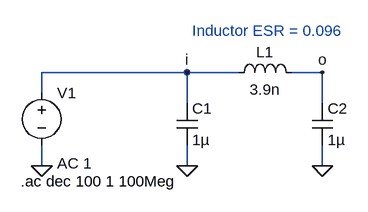
[diagram p0: schematic Pi_Filter_96mohm.asc]
Pi_Filter_96mohm.asc, the LTspice schematic file:
Version 4
SHEET 1 880 680
WIRE 64 96 -160 96
WIRE 144 96 64 96
WIRE 272 96 224 96
WIRE -160 128 -160 96
WIRE 64 144 64 96
WIRE 272 144 272 96
WIRE -160 240 -160 208
WIRE 64 240 64 208
WIRE 272 240 272 208
FLAG 64 240 0
FLAG 272 240 0
FLAG -160 240 0
FLAG 272 96 o
FLAG 64 96 i
SYMBOL cap 48 144 R0
SYMATTR InstName C1
SYMATTR Value 1µ
SYMBOL cap 256 144 R0
SYMATTR InstName C2
SYMATTR Value 1µ
SYMBOL ind 128 112 R270
WINDOW 0 32 56 VTop 2
WINDOW 3 5 56 VBottom 2
SYMATTR InstName L1
SYMATTR Value 3.9n
SYMATTR SpiceLine Rser=0.096
SYMBOL voltage -160 112 R0
WINDOW 123 24 124 Left 2
WINDOW 39 0 0 Left 0
SYMATTR Value2 AC 1
SYMATTR InstName V1
SYMATTR Value ""
TEXT -192 264 Left 2 !.ac dec 100 1 100Meg
TEXT 72 32 Left 2 ;Inductor ESR = 0.096

The netlist it stands for:
* Pi_Filter_96mohm.asc
C1 i 0 1µ
C2 o 0 1µ
L1 i o 3.9n Rser=0.096
V1 i 0 AC 1
.ac dec 100 1 100Meg
* Inductor ESR = 0.096
.backanno
.end